# Altium schematic sheet power.SchDoc
size A
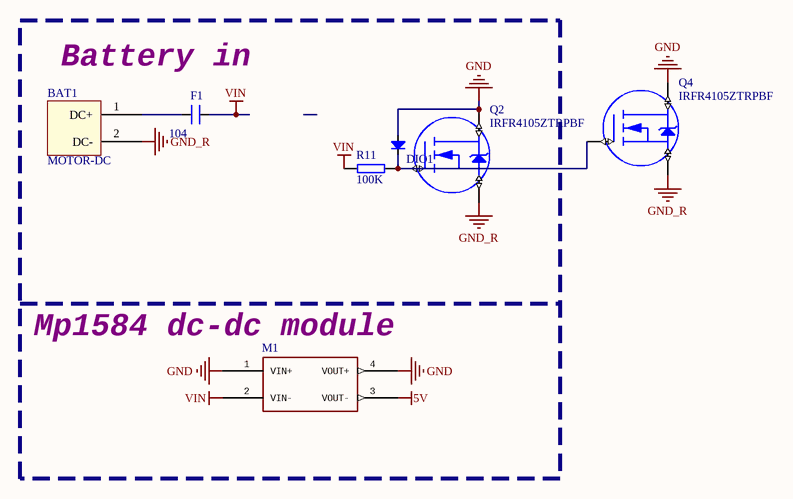
[diagram p0: power.SchDoc]

## Parts
BAT1  MOTOR-DC  [CON2-5.08DC]
DIO1  Diode SMD  [DIO-SMD-123]  (value not drawn)
F1  104  [CN2]
M1  MP1584-dc-brick-pcb Step down Input: 4.5V - 28V Ouput 0.8V - 25V max. 3A Cheap on ebay  [MP1584 MODULE]  (value not drawn)
Q2  IRFR4105ZTRPBF  [TO252-3]
Q4  IRFR4105ZTRPBF  [TO252-3]
R11  value 100K  [SMT0603]  (hidden comment: Resistor)

## Nets
5V: M1.3(VOUT-)
GND: DIO1.1(A) M1.1(VIN+) M1.4(VOUT+) Q2.2(D@1) Q4.2(D@1)
GND_R: BAT1.2(DC-) Q2.3(S) Q4.3(S)
VIN: F1.2 M1.2(VIN-) R11.2
NetBAT1_1: BAT1.1(DC+) F1.1
NetDIO1_2: DIO1.2(K) Q2.1(G) Q4.1(G) R11.1

Not connected (* = marked no-connect by the designer): Q2 PAD(D@2); Q4 PAD(D@2)

## Notes on the sheet
- Battery in
- (near M1) Mp1584 dc-dc module

## Library data of the parts
DIO1 = Diode SMD: Default Diode; Code - JEDEC: DO-214-AB; Value: 1N5007; Published: 8-Jun-2000; Revision: July-2002: Re-released for DXP Platform.; Publisher: Altium Limited
F1 = CN2: Cap np 104 => 105pF; Value: 0.1uF
M1 = MP1584
Q2 Q4 = IRFR4105ZTRPBF: RoHS Compliant | Industry-leading quality | Fast Switching | 175C Operating Temperature; MF: Infineon Technologies; MP: IRFR4105ZTRPBF; Check_prices: https://www.snapeda.com/parts/IRFR4105ZTRPBF/Infineon%20Technologies/view-part/821491/?ref=eda; Digi-Key_Part_Number: IRFR4105ZTRPBFCT-ND; Package: TO-252 International Rectifier; Purchase-URL: https://pricing.snapeda.com/search/part/IRFR4105ZTRPBF/?ref=eda; Value: *; SnapEDA_Link: https://www.snapeda.com/parts/IRFR4105ZTRPBF/Infineon%20Technologies/view-part/821491/?ref=snap
R11 = RES-SM-0603-100K: RES SM 0603 100K; Supplier 1: Farnell; Supplier 2: Digi-Key; Supplier Part Number 1: 1344361; Supplier Part Number 2: 541-100KHCT-ND